# EAGLE design extruder-controller (EAGLE 5.10)
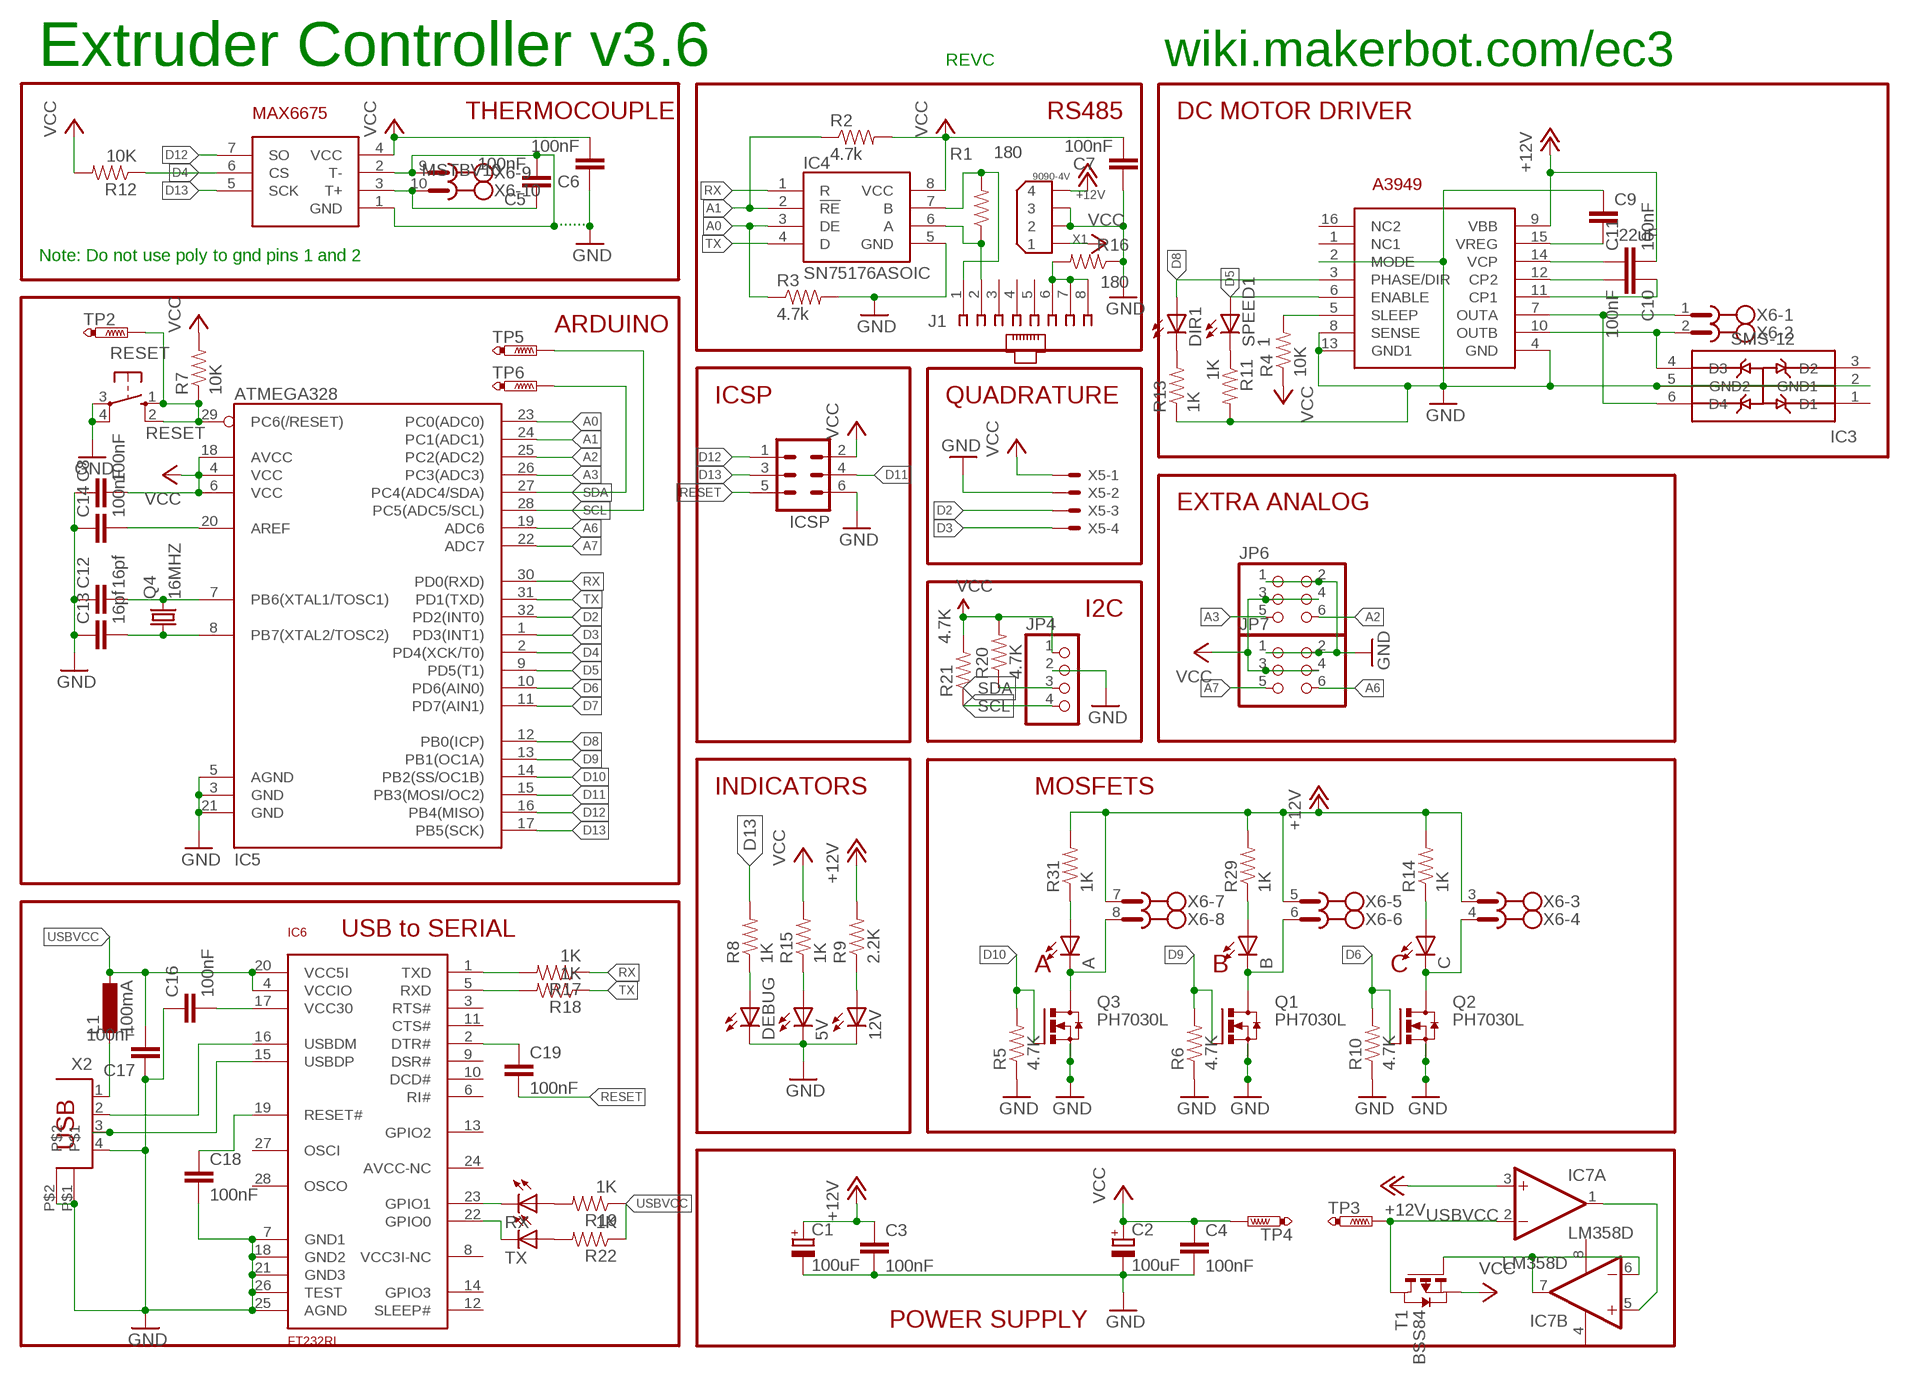
[diagram p0: schematic, sheet 1]

## Parts
5V  LED0805  [LED-0805]
12V  LED0805  [LED-0805]
A  LED0805  [LED-0805]
B  LED0805  [LED-0805]
C  LED0805  [LED-0805]
C1  100uF  CPOL-EUE3.5-8  [E3,5-8]
C2  100uF  CPOL-EUE3.5-8  [E3,5-8]
C3  100nF  CAP0805  [0805]
C4  100nF  CAP0805  [0805]
C5  100nF  CAP0805  [0805]
C6  100nF  CAP0805  [0805]
C7  100nF  CAP0805  [0805]
C8  100nF  CAP0805  [0805]
C9  .22uF  CAP0805  [0805]
C10  100nF  CAP0805  [0805]
C11  100nF  CAP0805  [0805]
C12  16pf  CAP0805  [0805]
C13  16pf  CAP0805  [0805]
C14  100nF  CAP0805  [0805]
C16  100nF  CAP0805  [0805]
C17  100nF  CAP0805  [0805]
C18  100nF  CAP0805  [0805]
C19  100nF  CAP0805  [0805]
DEBUG  LED0805  [LED-0805]
DIR1  LED0805  [LED-0805]
IC2  A3949  [SO16W]
IC3  SMS-12  TVS-DIODE-ARRAY  [SOT23-6]
IC4  SN75176ASOIC  [SO08]
IC5  ATMEGA328  ATMEGA168  [TQFP32-08]
IC6  FT232RL  [SMARTPRJ_SSOP28]
IC7  LM358D  [SO08]
IC8  MAX6675  [SO08]
ICSP  ML6  [ML6]
J1  520426-4  [520426-4]
JP4  PINHD-1X4  [1X04]
JP6  PINHD-2X3  [2X03]
JP7  PINHD-2X3  [2X03]
L1  100mA  L-EUL1812  [L1812]
Q1  PH7030L  [SOT669]
Q2  PH7030L  [SOT669]
Q3  PH7030L  [SOT669]
Q4  16MHZ  CRYSTALHC49S  [HC49/S]
R1  180  RESISTOR  [0805]
R2  4.7k  RESISTOR  [0805]
R3  4.7k  RESISTOR  [0805]
R4  10K  RESISTOR  [0805]
R5  4.7K  RESISTOR  [0805]
R6  4.7K  RESISTOR  [0805]
R7  10K  RESISTOR  [0805]
R8  1K  RESISTOR  [0805]
R9  2.2K  RESISTOR  [0805]
R10  4.7K  RESISTOR  [0805]
R11  1K  RESISTOR  [0805]
R12  10K  RESISTOR  [0805]
R13  1K  RESISTOR  [0805]
R14  1K  RESISTOR  [0805]
R15  1K  RESISTOR  [0805]
R16  180  RESISTOR  [0805]
R17  1K  RESISTOR  [0805]
R18  1K  RESISTOR  [0805]
R19  1K  RESISTOR  [0805]
R20  4.7K  RESISTOR  [0805]
R21  4.7K  RESISTOR  [0805]
R22  1K  RESISTOR  [0805]
R29  1K  RESISTOR  [0805]
R31  1K  RESISTOR  [0805]
RESET  10-XX  [B3F-10XX]
RX  LED0805  [LED-0805]
SPEED1  1  LED0805  [LED-0805]
T1  BSS84  PMOSSOT23  [SOT-23]
TP2  PTR1TP09R  [TP09R]
TP3  PTR1TP09R  [TP09R]
TP4  PTR1TP09R  [TP09R]
TP5  PTR1TP09R  [TP09R]
TP6  PTR1TP09R  [TP09R]
TX  LED0805  [LED-0805]
X1  9090-4V  [9090-4V]
X2  USBA  [SMARTPRJ_PN61729]
X5  C-GRID-04-70543  [70543-04]
X6  MSTBV10  [MSTBV10]

## Nets
+12V [power]: C1.+ C3.1 C11.2 IC2.9(VBB) IC7.3(A:+IN) R9.2 R14.2 R29.2 R31.2 X1.4 X6.3 X6.5 X6.7
A0: IC4.3(DE) IC5.23(PC0(ADC0)) R3.1
A1: IC4.2(!RE) IC5.24(PC1(ADC1)) R2.1
A2: IC5.25(PC2(ADC2)) JP6.6
A3: IC5.26(PC3(ADC3)) JP6.5
A6: IC5.19(ADC6) JP7.6
A7: IC5.22(ADC7) JP7.5
APWR [power]: A.C Q3.MB(D) X6.8
BPWR [power]: B.C Q1.MB(D) X6.6
CPWR: C.C Q2.MB(D) X6.4
D2: IC5.32(PD2(INT0)) X5.3
D3: IC5.1(PD3(INT1)) X5.4
D4: IC5.2(PD4(XCK/T0)) IC8.6(CS) R12.1
D5: IC2.6(ENABLE) IC5.9(PD5(T1)) SPEED1.A
D6: IC5.10(PD6(AIN0)) Q2.4(G) R10.2
D7: IC5.11(PD7(AIN1))
D8: DIR1.A IC2.3(PHASE/DIR) IC5.12(PB0(ICP))
D9: IC5.13(PB1(OC1A)) Q1.4(G) R6.2
D10: IC5.14(PB2(SS/OC1B)) Q3.4(G) R5.2
D11: IC5.15(PB3(MOSI/OC2)) ICSP.4
D12: IC5.16(PB4(MISO)) IC8.7(SO) ICSP.1
D13: IC5.17(PB5(SCK)) IC8.5(SCK) ICSP.3 R8.2
GND [power]: 5V.C 12V.C C1.- C2.- C3.2 C4.2 C6.1 C7.1 C8.1 C9.1 C12.1 C13.1 C14.1 C16.1 C17.1 C18.2 DEBUG.C IC2.2(MODE) IC2.4(GND) IC2.8(SENSE) IC2.13(GND1) IC3.2(GND1) IC3.5(GND2) IC4.5(GND) IC5.3(GND) IC5.5(AGND) IC5.21(GND) IC6.7(GND1) IC6.18(GND2) IC6.21(GND3) IC6.25(AGND) IC6.26(TEST) ICSP.6 JP4.2 JP6.1 JP6.2 JP7.1 JP7.2 Q1.1(S) Q1.2(S) Q1.3(S) Q2.1(S) Q2.2(S) Q2.3(S) Q3.1(S) Q3.2(S) Q3.3(S) R3.2 R5.1 R6.1 R10.1 R11.2 R13.1 R16.1 RESET.3(P) RESET.4(P1) X1.2 X1.3 X2.4 X2.P$1 X2.P$2 X5.2
N$1: C5.2 IC8.1(GND) IC8.2(T-) X6.9
N$2: C.A R14.1
N$3: C9.2 IC2.15(VREG)
N$4 [motors]: IC2.7(OUTA) IC3.6(D4) X6.1
N$5 [motors]: IC2.10(OUTB) IC3.4(D3) X6.2
N$6: C10.2 IC2.12(CP2)
N$7: C10.1 IC2.11(CP1)
N$8: DEBUG.A R8.1
N$9: C11.1 IC2.14(VCP)
N$11: C5.1 IC8.3(T+) X6.10
N$12: IC2.5(SLEEP) R4.2
N$18: R11.1 SPEED1.C
N$20: C14.2 IC5.20(AREF)
N$23: DIR1.C R13.2
N$25: 5V.A R15.1
N$26: 12V.A R9.1
N$29: IC6.15(USBDP) X2.3
N$30: IC6.16(USBDM) X2.2
N$31: C12.2 IC5.7(PB6(XTAL1/TOSC1)) Q4.2
N$32: C13.2 IC5.8(PB7(XTAL2/TOSC2)) Q4.1
N$36: C18.1 IC6.19(RESET#)
N$37: L1.2 X2.1
N$38: C16.2 IC6.17(VCC30)
N$39: R19.2 RX.A
N$40: R22.2 TX.A
N$41: A.A R31.1
N$42: B.A R29.1
N$44: IC6.23(GPIO1) RX.C
N$45: IC6.22(GPIO0) TX.C
N$46: C19.1 IC6.2(DTR#)
N$47: IC6.1(TXD) R17.2
N$48: IC6.5(RXD) R18.2
N$50: IC7.1(A:OUT) IC7.5(B:+IN)
N$51: IC7.6(B:-IN) IC7.7(B:OUT) T1.3(G)
N$83: J1.6 J1.7 J1.8 R16.2
RESET: C19.2 IC5.29(PC6(/RESET)) ICSP.5 R7.1 RESET.1(S) RESET.2(S1) TP2.TP
RS485A: IC4.6(A) J1.2 R1.1
RS485B: IC4.7(B) J1.1 R1.2
RX: IC4.1(R) IC5.30(PD0(RXD)) R17.1
SCL: IC5.28(PC5(ADC5/SCL)) JP4.4 R21.1 TP5.TP
SDA: IC5.27(PC4(ADC4/SDA)) JP4.3 R20.1 TP6.TP
TX: IC4.4(D) IC5.31(PD1(TXD)) R18.1
USBVCC: C17.2 IC6.4(VCCIO) IC6.20(VCC5I) IC7.2(A:-IN) L1.1 R19.1 R22.1 T1.1(D) TP3.TP
VCC: C2.+ C4.1 C6.2 C7.2 C8.2 IC4.8(VCC) IC5.4(VCC) IC5.6(VCC) IC5.18(AVCC) IC8.4(VCC) ICSP.2 JP4.1 JP6.3 JP6.4 JP7.3 JP7.4 R2.2 R4.1 R7.2 R12.2 R15.2 R20.2 R21.2 T1.2(S) TP4.TP X1.1 X5.1
Unconnected: IC2.1(NC1) IC2.16(NC2) IC3.1(D1) IC3.3(D2) IC6.3(RTS#) IC6.6(RI#) IC6.8(VCC3I-NC) IC6.9(DSR#) IC6.10(DCD#) IC6.11(CTS#) IC6.12(SLEEP#) IC6.13(GPIO2) IC6.14(GPIO3) IC6.24(AVCC-NC) IC6.27(OSCI) IC6.28(OSCO) J1.3 J1.4 J1.5

## Notes on the sheet
- wiki.makerbot.com/ec3
- Extruder Controller v3.6 | REVC
- THERMOCOUPLE | RS485 | DC MOTOR DRIVER
- .......
- Note: Do not use poly to gnd pins 1 and 2
- ARDUINO
- ICSP | QUADRATURE
- EXTRA ANALOG
- I2C
- INDICATORS | MOSFETS
- USB to SERIAL
- A | B | C
- POWER SUPPLY

## Power pins joined to a net without a drawn wire
V+: IC7.8(P:V+)
V-: IC7.4(P:V-)

## Library data of the parts
5V 12V A B C DEBUG DIR1 RX SPEED1 TX = SparkFun:LED: LEDs Standard schematic elements and footprints for 5mm, 3mm, 1206, and 0603 sized LEDs. 5mm - Spark Fun Electronics SKU : COM-00529 (and others)
C1 C2 = rcl:CPOL-EU: POLARIZED CAPACITOR, European symbol
C3-C14 C16-C19 = SparkFun:CAP: Capacitor Standard 0603 ceramic capacitor, and 0.1" leaded capacitor.
IC2 = reprap:A3949
IC3 = reprap:TVS-DIODE-ARRAY: Transient Voltage Protection Diode Array
IC4 = reprap:SN75176A
IC5 = SparkFun:ATMEGA168
IC6 = reprap:FT232RL
IC7 = linear:LM358: OP AMP also LM158; LM258; LM2904 Source: http://cache.national.com/ds/LM/LM158.pdf
IC8 = reprap:MAX6675: Thermocouple amplifier and A to D converter
ICSP = con-harting-ml:ML6: HARTING
J1 = con-amp:520426-4: AMP connector
JP4 = pinhead:PINHD-1X4: PIN HEADER
JP6 JP7 = pinhead:PINHD-2X3: PIN HEADER
L1 = resistor:L-EU: INDUCTOR, European symbol
Q1-Q3 = transistor-power:PH7030L: N-channel TrenchMOS (TM) logic level FET Source: http://www.nxp.com/acrobat_download/datasheets/PH7030L_4.pdf
Q4 = crystal:CRYSTAL: CRYSTAL
R1-R22 R29 R31 = SparkFun:RESISTOR: Resistor Basic schematic elements and footprints for 0603, 1206, and PTH 1/10th watt (small) resistors.
RESET = switch-omron:10-XX: OMRON SWITCH
T1 = zetex:PMOSSOT23: MOS FET
TP2-TP6 = testpad:PTR1: TEST PIN
X1 = con-thomas-betts:9090-4: Disk Drive Power four position Source: Thomas & Betts Electronic Interconnects Eiropean Edition 1998
X2 = reprap:USBA: BERG USB connector
X5 = reprap:C-GRID-04: CONNECTOR wire to board 2.54 mm (0.100") pitch header
X6 = con-phoenix-508:MSTBV10: PHOENIX

## Net classes
0 default: width 0.305 mm
1 power: width 1.016 mm
2 motors: width 0.61 mm

## Board
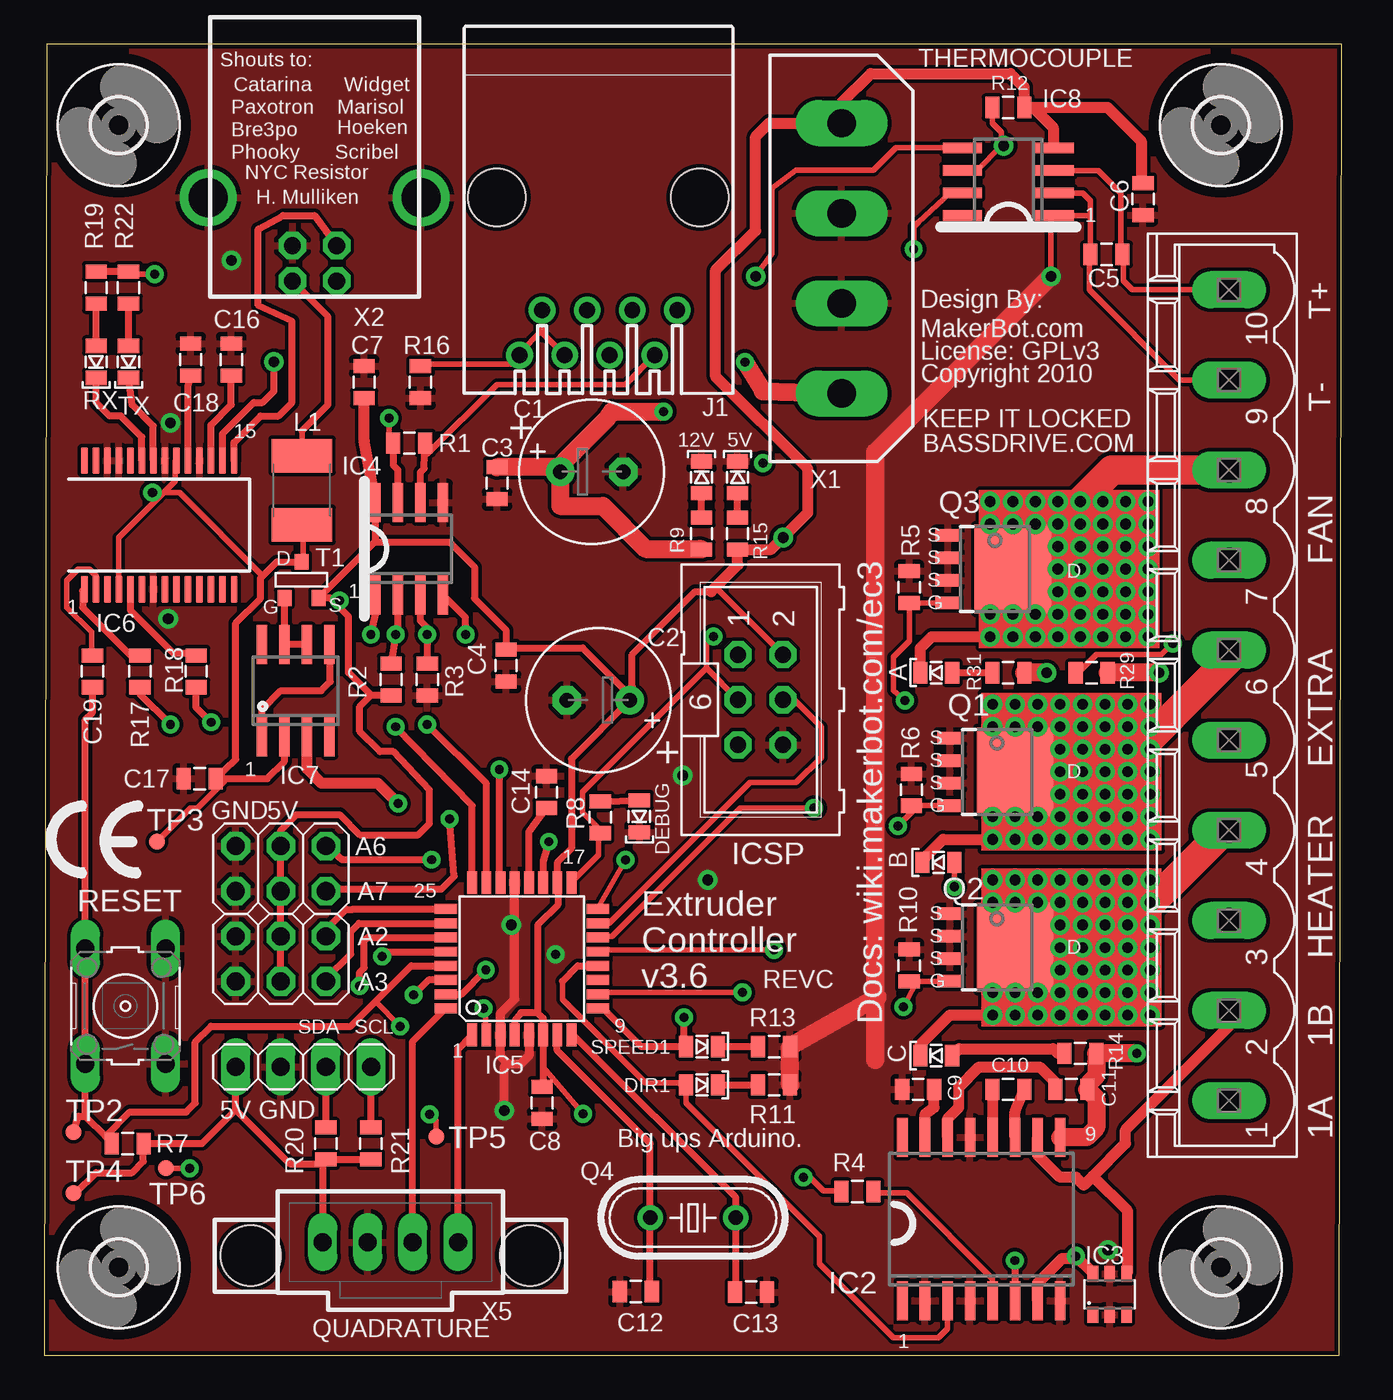
[diagram p1: board, top side]
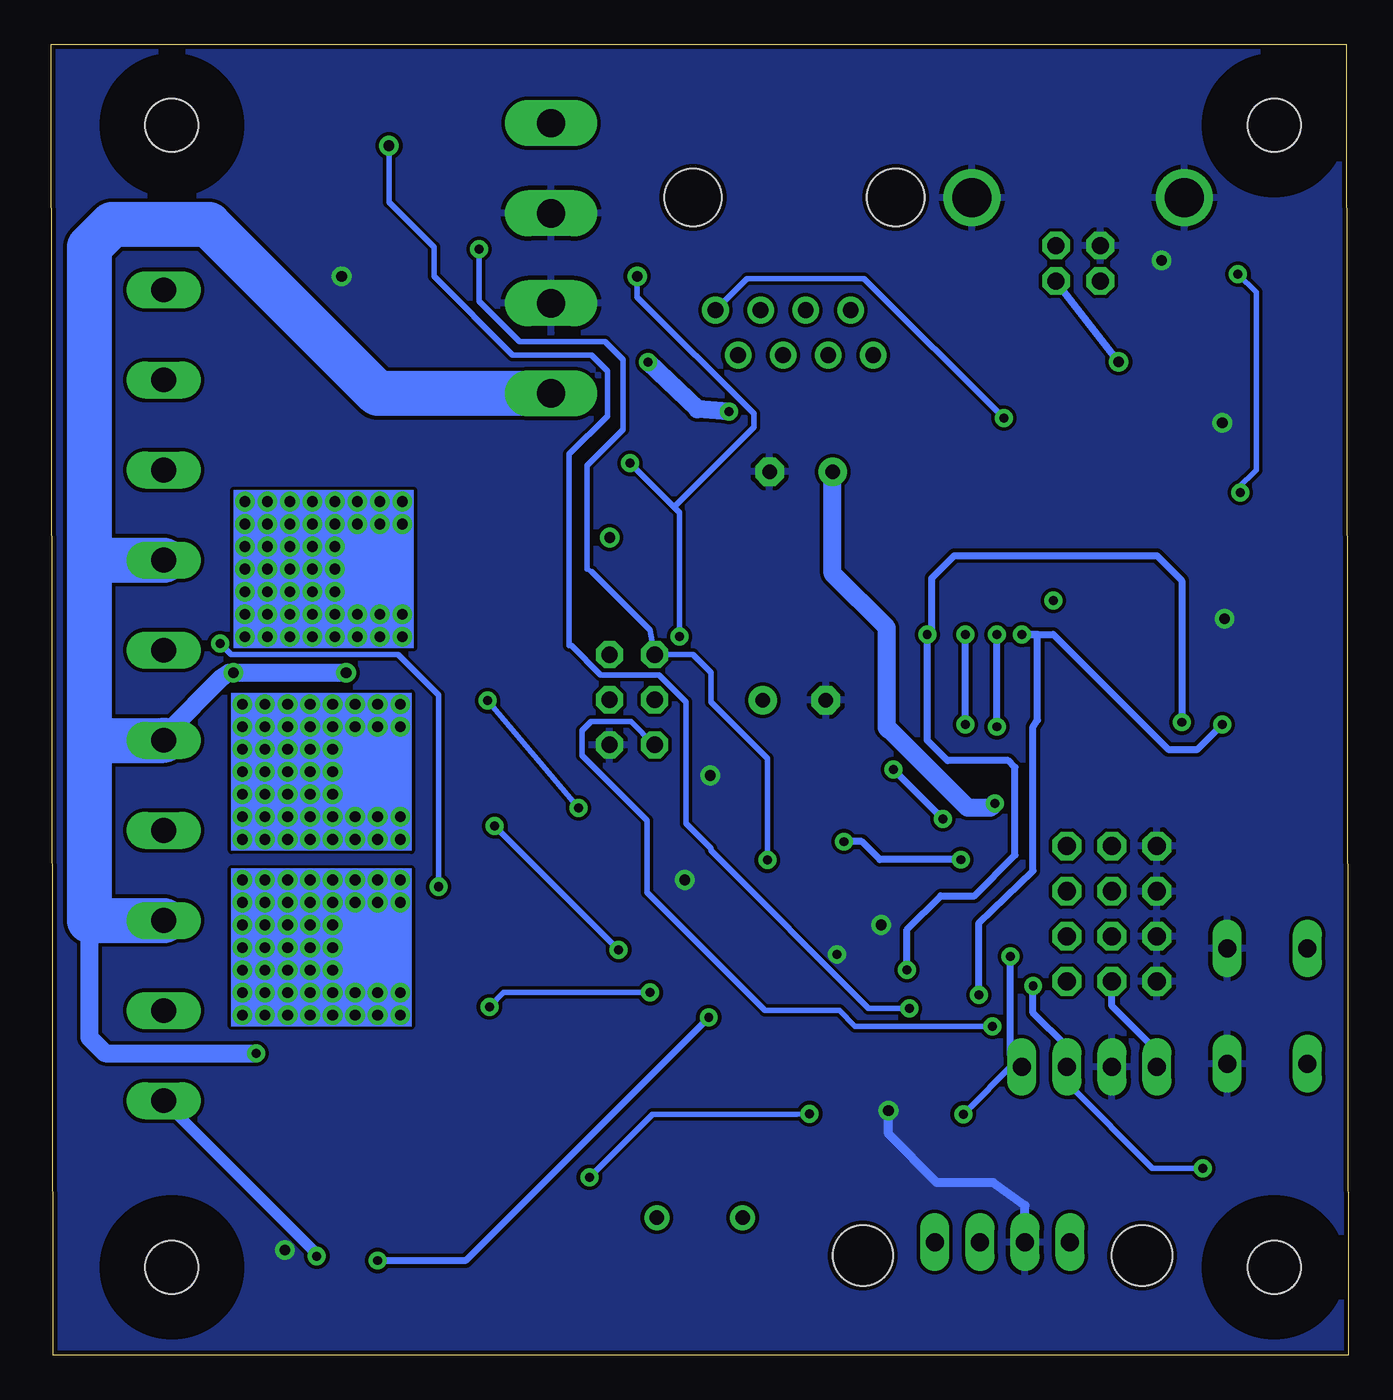
[diagram p2: board, bottom side, seen from below]

Size 73.15 x 73.91 mm. Coordinates in mm from the lower left corner, seen from the top.
Outline: 0,0 73.02,0 73.15,73.91 0.13,73.91 0,0
Copper layers (1*16): Top 0.035mm / dielectric 1.5mm / Bottom 0.035mm
Design rules "SparkFun *": minimum track width 8mil, minimum drill 20mil, track to track 8mil, track to pad 8mil, pad to pad 8mil, via to via 8mil, smd to smd 2mil, copper to edge 10mil, drill to drill 8mil, minimum pad ring 12mil, minimum via ring 10mil, stop-mask expansion 4mil, vias tented up to drill 25mil, thermal gap 10mil

### Footprints (pad centres in the part's own frame; a part is rotated, then mirrored left to right if it is on the bottom)
LED-0805 = smd 1.2 x 0.8: A 0,-0.9; C 0,0.9
E3,5-8 = drill 0.813 pad 1.6 round: + -1.778,0 | drill 0.813 pad 1.6 octagon: - 1.778,0
0805 = smd 0.8 x 1.2: 1 -0.9,0; 2 0.9,0
SO16W = smd 0.6 x 2.2: 1 -4.445,-4.6; 2 -3.175,-4.6; 3 -1.905,-4.6; 4 -0.635,-4.6; 5 0.635,-4.6; 6 1.905,-4.6; 7 3.175,-4.6; 8 4.445,-4.6; 9 4.445,4.6; 10 3.175,4.6; 11 1.905,4.6; 12 0.635,4.6; 13 -0.635,4.6; 14 -1.905,4.6; 15 -3.175,4.6; 16 -4.445,4.6
SOT23-6 = smd 0.6 x 0.9: 1 -0.95,-1.15; 2 0,-1.15; 3 0.95,-1.15; 4 0.95,1.15; 5 0,1.15; 6 -0.95,1.15
SO08 = smd 0.6 x 2.2: 1 -1.905,-2.6; 2 -0.635,-2.6; 3 0.635,-2.6; 4 1.905,-2.6; 5 1.905,2.6; 6 0.635,2.6; 7 -0.635,2.6; 8 -1.905,2.6
TQFP32-08 = smd 1.27 x 0.559: 1 -4.293,2.8; 2 -4.293,2; 3 -4.293,1.2; 4 -4.293,0.4; 5 -4.293,-0.4; 6 -4.293,-1.2; 7 -4.293,-2; 8 -4.293,-2.8; 17 4.293,-2.8; 18 4.293,-2; 19 4.293,-1.2; 20 4.293,-0.4; 21 4.293,0.4; 22 4.293,1.2; 23 4.293,2; 24 4.293,2.8 | smd 0.559 x 1.27: 9 -2.8,-4.293; 10 -2,-4.293; 11 -1.2,-4.293; 12 -0.4,-4.293; 13 0.4,-4.293; 14 1.2,-4.293; 15 2,-4.293; 16 2.8,-4.293; 25 2.8,4.293; 26 2,4.293; 27 1.2,4.293; 28 0.4,4.293; 29 -0.4,4.293; 30 -1.2,4.293; 31 -2,4.293; 32 -2.8,4.293
SMARTPRJ_SSOP28 = smd 0.381 x 1.499: 1 -4.225,-3.625; 2 -3.575,-3.625; 3 -2.925,-3.625; 4 -2.275,-3.625; 5 -1.625,-3.625; 6 -0.975,-3.625; 7 -0.325,-3.625; 8 0.325,-3.625; 9 0.975,-3.625; 10 1.625,-3.625; 11 2.275,-3.625; 12 2.925,-3.625; 13 3.575,-3.625; 14 4.225,-3.625; 15 4.225,3.625; 16 3.575,3.625; 17 2.925,3.625; 18 2.275,3.625; 19 1.625,3.625; 20 0.975,3.625; 21 0.325,3.625; 22 -0.325,3.625; 23 -0.975,3.625; 24 -1.625,3.625; 25 -2.275,3.625; 26 -2.925,3.625; 27 -3.575,3.625; 28 -4.225,3.625
ML6 = drill 0.914 octagon: 1 -2.54,-1.27; 2 -2.54,1.27; 3 0,-1.27; 4 0,1.27; 5 2.54,-1.27; 6 2.54,1.27
520426-4 = drill 0.889 round: 1 -4.445,6.35; 2 -3.175,8.89; 3 -1.905,6.35; 4 -0.635,8.89; 5 0.635,6.35; 6 1.905,8.89; 7 3.175,6.35; 8 4.445,8.89 | hole 3.251: -5.715,0; 5.715,0
1X04 = drill 1.016 long: 1 -3.81,0; 2 -1.27,0; 3 1.27,0; 4 3.81,0
2X03 = drill 1.016 octagon: 1 -2.54,-1.27; 2 -2.54,1.27; 3 0,-1.27; 4 0,1.27; 5 2.54,-1.27; 6 2.54,1.27
L1812 = smd 1.9 x 3.4: 1 -1.95,0; 2 1.95,0
SOT669 = smd 0.7 x 1.4: 1 -1.905,-2.65; 2 -0.635,-2.65; 3 0.635,-2.65; 4 1.905,-2.65 | smd 5 x 4.3: MB 0,1
HC49/S = drill 0.813 round: 1 -2.413,0; 2 2.413,0
B3F-10XX = drill 1.016 long: 1 -3.251,2.261; 2 3.251,2.261; 3 -3.251,-2.261; 4 3.251,-2.261
SOT-23 = smd 0.787 x 0.889: 1 0.025,-1.016; 2 -0.94,1.016; 3 0.991,1.016
TP09R = smd 0.9 x 0.9: TP 0,0
3,0 = hole 3: 0,0
9090-4V = drill 1.6 pad 2.6 long: 1 -7.62,0; 2 -2.54,0; 3 2.54,0; 4 7.62,0
SMARTPRJ_PN61729 = drill 0.95 octagon: 1 1.25,4.71; 2 -1.25,4.71; 3 -1.25,2.71; 4 1.25,2.71 | drill 2.2 round: P$1 -6,0; P$2 6,0
70543-04 = drill 1.016 long: 1 -3.81,0; 2 -1.27,0; 3 1.27,0; 4 3.81,0 | hole 3.404: -7.874,-0.762; 7.874,-0.762
MSTBV10 = drill 1.397 long: 1 -22.86,0; 2 -17.78,0; 3 -12.7,0; 4 -7.62,0; 5 -2.54,0; 6 2.54,0; 7 7.62,0; 8 12.7,0; 9 17.78,0; 10 22.86,0

### Placement (x,y rotation side)
5V  39.09,49.5 0 top
12V  37.06,49.5 0 top
A  50.29,38.48 90 top
B  50.42,27.79 90 top
C  50.29,16.89 90 top
C1  30.86,49.81 0 top
C2  31.24,36.93 180 top
C3  25.53,49.17 270 top
C4  26.04,38.89 270 top
C5  59.89,62.07 180 top
C6  61.95,65.19 90 top
C7  18.03,54.86 270 top
C8  28.07,14.22 90 top
C9  49.28,14.99 0 top
C10  54.36,14.99 180 top
C11  57.91,14.99 0 top
C12  33.35,3.58 0 top
C13  39.85,3.56 180 top
C14  28.32,31.75 270 top
C16  10.54,56.13 270 top
C17  8.76,32.51 0 top
C18  8.26,56.13 90 top
C19  2.72,38.56 270 top
DEBUG  33.55,30.38 180 top
DIR1  37.08,15.24 270 top
IC2  52.83,7.67 0 top
IC3  60.07,3.43 0 top
IC4  20.57,45.47 0 top
IC5  26.92,22.35 90 top
IC6  6.48,46.81 0 top
IC7  14.17,37.47 0 top
IC8  54.36,66.17 90 top
ICSP  40.39,36.96 270 top
J1  31.24,65.28 180 top
JP4  14.61,16.26 0 top
JP6  13.34,22.35 0 top
JP7  13.34,27.43 0 top
L1  14.53,48.77 90 top
Q1  53.72,32.89 270 top
Q2  53.72,22.99 270 top
Q3  53.59,44.32 270 top
Q4  36.58,7.75 180 top
R1  20.57,51.44 180 top
R2  19.56,38.1 270 top
R3  21.59,38.1 270 top
R4  45.85,9.22 0 top
R5  48.77,43.31 270 top
R6  48.9,31.88 270 top
R7  4.7,11.94 0 top
R8  31.34,30.33 270 top
R9  37.06,46.33 270 top
R10  48.77,21.97 270 top
R11  41.15,17.4 0 top
R12  54.36,70.36 0 top
R13  41.15,15.24 180 top
R14  58.42,17.02 0 top
R15  39.09,46.33 270 top
R16  21.21,54.86 90 top
R17  5.38,38.56 90 top
R18  8.56,38.56 90 top
R19  2.92,60.2 270 top
R20  15.88,11.94 270 top
R21  18.41,11.94 270 top
R22  4.75,60.2 270 top
R29  59.05,38.48 0 top
R31  54.36,38.48 0 top
RESET  4.57,19.68 90 top
RX  2.92,56.01 180 top
SPEED1  37.08,17.4 270 top
T1  14.53,43.71 180 top
TP2  1.65,12.57 0 top
TP3  6.35,28.96 0 top
TP4  1.65,9.14 0 top
TP5  22.1,12.32 0 top
TP6  6.86,10.54 0 top
TX  4.75,56.01 180 top
U$1  [3,0]  4.19,4.95 0 top
U$2  [3,0]  4.19,69.35 0 top
U$3  [3,0]  66.34,69.35 0 top
U$4  [3,0]  66.34,4.95 0 top
X1  44.96,61.85 270 top
X2  15.24,65.28 180 top
X5  19.51,6.38 0 top
X6  66.8,37.21 90 top

### Tracks (layer width: path | path; a pad name or v marks a point on that pad's centre or on a via)
+12V  (via drill 0.5, 0.51, 0.6)
  Top 0.61: v61.6,17.02 61.58,17.01 | v19.94,31.11 18.8,32.26 15.62,32.26 14.81,33.07 IC7.3
  Top 1.016: C1.+ 29.08,50.04 | C1.+ 29.08,47.88 31.5,47.88 33.91,45.47 36.96,45.47 R9.2 | v62.87,38.48 R29.2 | v56.52,38.48 R31.2 | C1.+ 29.34,50.42 31.75,52.83 32,53.21 v34.93,53.21 | v39.5,56.01 40.51,54.36 X1.4 | R14.2 59.31,17.01 | C1.+ 28.82,50.07 C3.1 | R14.2 59.31,16.51 59.31,15.75 58.93,15.37 C11.2 59.31,14.49 59.31,12.83 58.78,12.3 IC2.9 | v61.6,17.02 R14.2
  Bottom 1.016: v19.94,31.11 20.19,30.86 21.46,30.86 25.83,35.23 25.88,35.23 26.04,35.38 26.04,41.02 29.08,44.07 C1.+ | v56.52,38.48 v62.87,38.48 63.12,38.48 63.5,38.23 66.67,35.05 X6.5 | v34.93,53.21 36.7,53.34 v39.5,56.01 | v61.6,17.02 70.1,17.02 70.99,17.91 70.99,24.51
  Bottom 2.54: X1.4 54.74,54.23 64.26,63.75 69.72,63.75 70.99,62.48 70.99,44.83 | 70.99,44.83 70.99,34.67 | X6.3 70.99,24.51 70.99,34.67 | 70.99,34.67 X6.5 | 70.99,44.83 X6.7
A0  (via drill 0.5)
  Top 0.406: R3.1 v21.59,40.64 21.59,41.02 21.21,41.4 IC4.3 | IC5.23 24.92,32.23 v21.59,35.56
  Bottom 0.406: v21.59,35.56 v21.59,40.64
A1  (via drill 0.5)
  Top 0.406: IC4.2 19.94,41.02 v19.81,40.64 R2.1 | IC5.24 24.12,30.99 v19.81,35.43
  Bottom 0.406: v19.81,35.43 v19.81,40.64
A2
  Top 0.406: IC5.25 17.4,25.15 17.02,25.15 16,24.13 JP6.6
A3
  Top 0.406: IC5.26 17.75,24.35 17.27,23.88 17.27,22.61 15.88,21.21 JP6.5
A6  (via drill 0.5)
  Top 0.406: IC5.19 28.12,27.87 v28.45,28.96 | v21.84,27.94 16.76,27.94 JP7.6
  Bottom 0.406: v28.45,28.96 27.43,28.96 26.42,27.94 v21.84,27.94
A7  (via drill 0.5)
  Top 0.406: v22.86,30.23 23.11,27.01 22.4,26.29 16,26.29 JP7.5 | IC5.22 25.65,26.64 v25.65,33.02
  Bottom 0.406: v22.86,30.23 v25.65,33.02
APWR
  Top 0.61: A.C 49.39,39.87 50.04,40.51 54.61,40.51 54.61,44.31 Q3.MB
  Top 1.676: X6.8 60.18,49.91 Q3.MB
BPWR
  Top 0.61: Q1.MB 54.72,29.1 54.71,29.08 50.67,29.08 49.52,27.93 B.C
  Top 1.676: X6.6 66.8,39.22 60.48,32.89 Q1.MB
CPWR
  Top 0.61: C.C 49.39,17.52 51.05,19.18 54.74,19.18 54.72,19.19 Q2.MB
  Top 1.676: X6.4 66.52,29.59 59.92,22.99 Q2.MB
D2
  Top 0.406: X5.3 20.78,17.7 IC5.32
D3
  Top 0.406: X5.4 23.32,17.25 IC5.1
D4  (via drill 0.51, 0.6)
  Top 0.305: v24.77,19.56 24.89,19.43 24.89,18.16 IC5.2 | R12.1 53.47,69.47 53.98,68.96 53.98,68.33 v54.1,68.2 53.98,68.2 52.58,66.8 IC8.6
  Bottom 0.305: v24.77,19.56 27.05,19.56 35.94,28.45 35.94,28.57 37.34,29.97 37.34,36.83 38.86,38.35 42.16,38.35 43.82,40.01 43.94,40.01 43.94,50.8 41.78,52.96 41.78,55.5 42.67,56.39 47.12,56.39 51.56,60.83 51.56,62.48 54.1,65.02 v54.1,68.2
D5  (via drill 0.5)
  Top 0.305: v36.07,19.05 36.2,19.18
  Top 0.406: IC5.9 31.5,19.55 33.66,17.4 SPEED1.A 36.07,17.43 v36.07,19.05 | v54.74,5.33 IC2.6
  Bottom 0.406: v54.74,5.33 49.78,5.33 v36.07,19.05
D6  (via drill 0.51)
  Top 0.305: Q2.4 48.78,21.08 R10.2 49.15,20.95 v48.44,19.63 | v39.37,20.45 31.24,20.45 IC5.10
  Bottom 0.305: v39.37,20.45 47.62,20.45 v48.44,19.63
D8
  Top 0.305: 29.21,21.08 29.21,20.07 33.91,15.37 35.91,15.37 DIR1.A 36.2,14.99 36.2,14.22 43.71,6.71 43.71,5.16 47.88,0.99 50.42,0.99 50.93,1.5 IC2.3
  Top 0.406: IC5.12 30.08,21.95 29.21,21.08
  Top 0.61: 36.07,15.21 DIR1.A
D9  (via drill 0.51)
  Top 0.305: v41.15,22.86 31.24,22.86 IC5.13 | v48.13,29.84 49.15,30.86 R6.2 Q1.4
  Bottom 0.305: v41.15,22.86 v48.13,29.84
D10  (via drill 0.51)
  Top 0.305: IC5.14 31.24,23.62 32,23.62 39.24,30.86 v43.41,30.86 | v48.54,36.91 47.88,37.47 47.88,39.37 48.77,40.26 R5.2 48.78,42.42 Q3.4
  Bottom 0.305: v43.41,30.86 v48.54,36.91
D11
  Top 0.305: IC5.15 31.84,24.35 39.78,32.28 42.39,32.28 43.82,33.71 43.82,35.43 42.19,37.06 41.78,37.06 41.78,37.08 ICSP.4
D12  (via drill 0.5, 0.51)
  Top 0.305: v32.77,27.91 31.24,25.27 IC5.16 | v49.02,62.36 49.02,63.63 49.28,63.88 51.05,65.53 IC8.7
  Bottom 0.305: v32.77,27.91 32.77,33.66 35.94,36.83 35.94,38.48 36.96,39.5 ICSP.1 39.37,40.89 42.67,44.2 42.93,44.32 42.93,50.17 40.89,52.2 40.89,56.13 41.91,57.15 46.74,57.15 49.02,59.44 v49.02,62.36
D13  (via drill 0.51, 0.6 pad 0)
  Top 0.305: IC5.17 29.72,26.67 31.24,28.19 31.24,29.34 R8.2 31.24,29.46 31.24,29.72 30.35,30.61 30.35,31.75 37.34,38.73 | v37.72,40.51 37.34,40.13 37.34,38.73 | 37.34,38.73 ICSP.3 | IC8.5 48.01,68.07 46.76,66.83 42.39,66.83 41.02,65.81 41.02,62.1 v40.11,60.83
  Bottom 0.305: 38.04,47.82 37.72,47.5 v37.72,40.51 | 38.04,47.82 v40.51,50.29 | 38.04,47.82 33.53,52.32 33.53,53.09 40.11,59.67 v40.11,60.83
GND  (via drill 0.51, 0.6, 0.6 pad 0)
  Top 0.508: IC5.21 26.52,20.07 25.73,19.28 IC5.3 | IC5.3 | IC5.3 25.73,16.84 26.14,16.43 | 26.14,16.43 26.85,16.43 27.36,16.94 27.36,18.03 IC5.5 | v25.93,13.79 25.93,16.23 26.14,16.43
  Top 1.016: 46.99,20.19 R11.2 R13.1 | v56.77,60.83 46.86,50.93 46.86,16.64
  Bottom 0.508: X5.2 18.24,8.43 20.04,9.73 23.19,9.73 25.93,12.47 v25.93,13.79
  other vias: 7.11,52.58 6.98,41.53 10.54,61.72 59.97,5.92 26.34,24.26 28.83,22.61 35.99,32.69 37.41,26.8
  pour Top: -1.14,74.55 73.79,74.55 73.79,-1.65 -1.14,-1.65
  pour Bottom: -1.14,74.55 73.79,74.55 73.79,-1.65 -1.14,-1.65
N$1
  Top 0.305: X6.9 64.01,54.99 58.93,60.07 58.93,62.01 C5.2 58.99,64.26 | 58.99,64.26 58.99,65.09 58.55,65.53 IC8.2 | 58.99,64.26 IC8.1 56.77,64.08 56.77,60.83
N$2
  Top 0.61: R14.1 57.15,17.02 56.9,17.27 51.57,17.27 C.A
N$3
  Top 0.61: IC2.15 49.66,13.59 50.16,13.97 50.16,14.97 C9.2
N$4  (via drill 0.51)
  Top 0.61: IC3.6 59.05,4.7 v58.17,5.59 57.91,5.46 57.4,5.46 56.01,4.06 IC2.7
  Bottom 0.61: X6.1 58.42,5.97 58.29,5.71 v58.17,5.59
N$5
  Top 0.61: IC2.10 56.01,11.3 57.28,10.03 58.17,10.03 58.61,9.59 59.12,10.1 | X6.2 66.8,18.54 60.96,12.7 60.96,11.94 59.12,10.1 | IC3.4 61.09,4.7 61.09,8.13 59.12,10.1
N$6
  Top 0.61: IC2.12 53.47,14.97 C10.2
N$7
  Top 0.61: C10.1 54.74,13.72 IC2.11
N$8
  Top 0.406: R8.1 DEBUG.A
N$9
  Top 0.61: C11.1 57.01,15.38 56.13,16.26 52.71,16.26 51.56,15.11 51.56,13.97 50.93,13.33 IC2.14
N$10  (via drill 0.6 pad 0)
  other vias: 53.34,48.13
N$11
  Top 0.305: X6.10 61.34,60.07 60.83,60.58 60.83,62.03 C5.1 60.71,62.16 60.71,65.53 59.44,66.8 IC8.3
N$12
  Top 0.305: R4.2 46.86,9.14 48.64,9.14 53.47,4.32 IC2.5
N$13  (via drill 0.6 pad 0)
  other vias: 54.61,48.13
N$14  (via drill 0.6 pad 0)
  other vias: 55.88,48.13
N$15  (via drill 0.6 pad 0)
  other vias: 57.15,48.13
N$16  (via drill 0.6 pad 0)
  other vias: 58.42,48.13
N$17  (via drill 0.6 pad 0)
  other vias: 59.69,48.13
N$18
  Top 0.406: SPEED1.C R11.1
N$19  (via drill 0.6 pad 0)
  other vias: 60.96,48.13
N$20
  Top 0.406: IC5.20 27.32,29.51 C14.2
N$21  (via drill 0.6 pad 0)
  other vias: 62.23,48.13
N$22  (via drill 0.6 pad 0)
  other vias: 62.23,46.86
N$23
  Top 0.406: DIR1.C R13.2
N$24  (via drill 0.6 pad 0)
  other vias: 60.96,46.86
N$25
  Top 0.406: R15.1 5V.A
N$26
  Top 0.406: R9.1 12V.A
N$27  (via drill 0.6 pad 0)
  other vias: 59.69,46.86
N$28  (via drill 0.6 pad 0)
  other vias: 58.42,46.86
N$29
  Top 0.406: IC6.15 10.7,51.47 12.19,52.96 13.21,52.96 13.97,53.72 13.97,58.29 12.07,59.18 12.07,63.5 13.46,64.26 15.24,64.26 X2.3
N$30  (via drill 0.6)
  Top 0.406: IC6.16 10.05,51.96 11.81,53.72 12.32,53.72 12.95,54.36 v12.95,56.01
  Bottom 0.406: v12.95,56.01 X2.2
N$31
  Top 0.406: IC5.7 28.92,17.18 34.16,11.94 Q4.2 34.16,3.62 C12.2
N$32
  Top 0.406: IC5.8 29.82,18.06 38.99,8.89 Q4.1 38.99,3.57 C13.2
N$33  (via drill 0.6 pad 0)
  other vias: 57.15,46.86
N$34  (via drill 0.6 pad 0)
  other vias: 55.88,46.86
N$35  (via drill 0.6 pad 0)
  other vias: 54.61,46.86
N$36
  Top 0.406: IC6.19 8.1,54.65 C18.1
N$37
  Top 0.305: L1.2 14.53,52.12
  Top 0.406: 14.53,52.12 16,53.59 16,58.55 X2.1
N$38
  Top 0.406: IC6.17 9.4,52.46 10.54,53.59 C16.2
N$39
  Top 0.406: RX.A R19.2
N$40
  Top 0.406: TX.A R22.2
N$41
  Top 0.406: A.A R31.1
N$42  (via drill 0.51)
  Top 0.305: 58.29,38.61 R29.1 58.42,38.61 59.31,39.5 62.99,39.5 v63.63,40.13 | v51.31,26.42 51.31,27.69 B.A
  Bottom 0.305: v51.31,26.42 51.31,37.21 53.59,39.5 62.99,39.5 v63.63,40.13
N$43  (via drill 0.6 pad 0)
  other vias: 53.34,46.86
N$44
  Top 0.406: IC6.23 5.5,51.78 4.32,52.96 3.68,52.96 2.92,53.72 RX.C
N$45
  Top 0.406: IC6.22 6.15,52.4 4.95,53.59 TX.C
N$46
  Top 0.305: C19.1 2.67,39.5 2.67,40.77 1.27,42.16 1.27,43.69 1.91,44.32 2.54,44.32 2.92,43.94 2.92,43.31 IC6.2
N$47
  Top 0.406: R17.2 4.87,39.46 2.16,42.16 2.16,43.09 IC6.1
N$48
  Top 0.305: R18.2 8.51,39.5 8.38,39.59
  Top 0.406: IC6.5 4.85,42.01 7.28,39.59 8.38,39.59
N$50
  Top 0.406: IC7.1 12.27,36.4 13.34,37.47 15.62,37.47 16.13,37.97 16.13,40.01 IC7.5
N$51
  Top 0.406: T1.3 IC7.7 IC7.6
N$54  (via drill 0.6 pad 0)
  other vias: 57.15,45.59
N$55  (via drill 0.6 pad 0)
  other vias: 58.42,45.59
N$56  (via drill 0.6 pad 0)
  other vias: 59.69,45.59
N$57  (via drill 0.6 pad 0)
  other vias: 60.96,45.59
N$58  (via drill 0.6 pad 0)
  other vias: 62.23,45.59
N$62  (via drill 0.6 pad 0)
  other vias: 57.15,44.32
N$63  (via drill 0.6 pad 0)
  other vias: 58.42,44.32
N$64  (via drill 0.6 pad 0)
  other vias: 59.69,44.32
N$65  (via drill 0.6 pad 0)
  other vias: 60.96,44.32
N$66  (via drill 0.6 pad 0)
  other vias: 62.23,44.32
N$70  (via drill 0.6 pad 0)
  other vias: 57.15,43.05
N$71  (via drill 0.6 pad 0)
  other vias: 58.42,43.05
N$72  (via drill 0.6 pad 0)
  other vias: 59.69,43.05
N$73  (via drill 0.6 pad 0)
  other vias: 60.96,43.05
N$74  (via drill 0.6 pad 0)
  other vias: 62.23,43.05
N$75  (via drill 0.6 pad 0)
  other vias: 62.23,41.78
N$76  (via drill 0.6 pad 0)
  other vias: 60.96,41.78
N$77  (via drill 0.6 pad 0)
  other vias: 59.69,41.78
N$78  (via drill 0.6 pad 0)
  other vias: 58.42,41.78
N$79  (via drill 0.6 pad 0)
  other vias: 57.15,41.78
N$80  (via drill 0.6 pad 0)
  other vias: 55.88,41.78
N$81  (via drill 0.6 pad 0)
  other vias: 54.61,41.78
N$82  (via drill 0.6 pad 0)
  other vias: 53.34,41.78
N$83
  Top 0.305: R16.2 21.21,55.88 26.29,55.88 J1.8 26.8,56.52 28.07,57.79 | 28.07,57.79 J1.7 | J1.6 28.07,57.66 28.07,57.79
N$84  (via drill 0.6 pad 0)
  Top 0.61: v53.34,40.51 v54.61,40.51
N$85  (via drill 0.6 pad 0)
  other vias: 55.88,40.51
N$86  (via drill 0.6 pad 0)
  other vias: 57.15,40.51
N$87  (via drill 0.6 pad 0)
  other vias: 58.42,40.51
N$88  (via drill 0.6 pad 0)
  other vias: 59.69,40.51
N$89  (via drill 0.6 pad 0)
  other vias: 60.96,40.51
N$90  (via drill 0.6 pad 0)
  other vias: 62.23,40.51
N$91  (via drill 0.6 pad 0)
  other vias: 53.47,36.7
N$92  (via drill 0.6 pad 0)
  other vias: 54.74,36.7
N$93  (via drill 0.6 pad 0)
  other vias: 56.01,36.7
N$94  (via drill 0.6 pad 0)
  other vias: 57.28,36.7
N$95  (via drill 0.6 pad 0)
  other vias: 58.55,36.7
N$96  (via drill 0.6 pad 0)
  other vias: 59.82,36.7
N$97  (via drill 0.6 pad 0)
  other vias: 61.09,36.7
N$98  (via drill 0.6 pad 0)
  other vias: 62.36,36.7
N$99  (via drill 0.6 pad 0)
  other vias: 62.36,35.43
N$100  (via drill 0.6 pad 0)
  other vias: 61.09,35.43
N$101  (via drill 0.6 pad 0)
  other vias: 59.82,35.43
N$102  (via drill 0.6 pad 0)
  other vias: 58.55,35.43
N$103  (via drill 0.6 pad 0)
  other vias: 57.28,35.43
N$104  (via drill 0.6 pad 0)
  other vias: 56.01,35.43
N$105  (via drill 0.6 pad 0)
  other vias: 54.74,35.43
N$106  (via drill 0.6 pad 0)
  other vias: 53.47,35.43
N$110  (via drill 0.6 pad 0)
  other vias: 57.28,34.16
N$111  (via drill 0.6 pad 0)
  other vias: 58.55,34.16
N$112  (via drill 0.6 pad 0)
  other vias: 59.82,34.16
N$113  (via drill 0.6 pad 0)
  other vias: 61.09,34.16
N$114  (via drill 0.6 pad 0)
  other vias: 62.36,34.16
N$115  (via drill 0.6 pad 0)
  other vias: 62.36,32.89
N$116  (via drill 0.6 pad 0)
  other vias: 61.09,32.89
N$117  (via drill 0.6 pad 0)
  other vias: 59.82,32.89
N$118  (via drill 0.6 pad 0)
  other vias: 58.55,32.89
N$119  (via drill 0.6 pad 0)
  other vias: 57.28,32.89
N$126  (via drill 0.6 pad 0)
  other vias: 57.28,31.62
N$127  (via drill 0.6 pad 0)
  other vias: 58.55,31.62
N$128  (via drill 0.6 pad 0)
  other vias: 59.82,31.62
N$129  (via drill 0.6 pad 0)
  other vias: 61.09,31.62
N$130  (via drill 0.6 pad 0)
  other vias: 62.36,31.62
N$131  (via drill 0.6 pad 0)
  other vias: 53.47,30.35
N$132  (via drill 0.6 pad 0)
  other vias: 54.74,30.35
N$133  (via drill 0.6 pad 0)
  other vias: 56.01,30.35
N$134  (via drill 0.6 pad 0)
  other vias: 57.28,30.35
N$135  (via drill 0.6 pad 0)
  other vias: 58.55,30.35
N$136  (via drill 0.6 pad 0)
  other vias: 59.82,30.35
N$137  (via drill 0.6 pad 0)
  other vias: 61.09,30.35
N$138  (via drill 0.6 pad 0)
  other vias: 62.36,30.35
N$139  (via drill 0.6 pad 0)
  other vias: 62.36,29.08
N$140  (via drill 0.6 pad 0)
  other vias: 61.09,29.08
N$141  (via drill 0.6 pad 0)
  other vias: 59.82,29.08
N$142  (via drill 0.6 pad 0)
  other vias: 58.55,29.08
N$143  (via drill 0.6 pad 0)
  other vias: 57.28,29.08
N$144  (via drill 0.6 pad 0)
  other vias: 56.01,29.08
N$145  (via drill 0.6 pad 0)
  other vias: 54.74,29.08
N$146  (via drill 0.6 pad 0)
  other vias: 53.47,29.08
N$147  (via drill 0.6 pad 0)
  other vias: 53.47,26.8
N$148  (via drill 0.6 pad 0)
  other vias: 54.74,26.8
N$149  (via drill 0.6 pad 0)
  other vias: 56.01,26.8
N$150  (via drill 0.6 pad 0)
  other vias: 57.28,26.8
N$151  (via drill 0.6 pad 0)
  other vias: 58.55,26.8
N$152  (via drill 0.6 pad 0)
  other vias: 59.82,26.8
N$153  (via drill 0.6 pad 0)
  other vias: 61.09,26.8
N$154  (via drill 0.6 pad 0)
  other vias: 62.36,26.8
N$155  (via drill 0.6 pad 0)
  other vias: 62.36,25.53
N$156  (via drill 0.6 pad 0)
  other vias: 61.09,25.53
N$157  (via drill 0.6 pad 0)
  other vias: 59.82,25.53
N$158  (via drill 0.6 pad 0)
  other vias: 58.55,25.53
N$159  (via drill 0.6 pad 0)
  other vias: 57.28,25.53
N$160  (via drill 0.6 pad 0)
  other vias: 56.01,25.53
N$161  (via drill 0.6 pad 0)
  other vias: 54.74,25.53
N$162  (via drill 0.6 pad 0)
  other vias: 53.47,25.53
N$166  (via drill 0.6 pad 0)
  other vias: 57.28,24.26
N$167  (via drill 0.6 pad 0)
  other vias: 58.55,24.26
N$168  (via drill 0.6 pad 0)
  other vias: 59.82,24.26
N$169  (via drill 0.6 pad 0)
  other vias: 61.09,24.26
N$170  (via drill 0.6 pad 0)
  other vias: 62.36,24.26
N$171  (via drill 0.6 pad 0)
  other vias: 62.36,22.99
N$172  (via drill 0.6 pad 0)
  other vias: 61.09,22.99
N$173  (via drill 0.6 pad 0)
  other vias: 59.82,22.99
N$174  (via drill 0.6 pad 0)
  other vias: 58.55,22.99
N$175  (via drill 0.6 pad 0)
  other vias: 57.28,22.99
N$182  (via drill 0.6 pad 0)
  other vias: 57.28,21.72
N$183  (via drill 0.6 pad 0)
  other vias: 58.55,21.72
N$184  (via drill 0.6 pad 0)
  other vias: 59.82,21.72
N$185  (via drill 0.6 pad 0)
  other vias: 61.09,21.72
N$186  (via drill 0.6 pad 0)
  other vias: 62.36,21.72
N$187  (via drill 0.6 pad 0)
  other vias: 62.36,20.45
N$188  (via drill 0.6 pad 0)
  other vias: 61.09,20.45
N$189  (via drill 0.6 pad 0)
  other vias: 59.82,20.45
N$190  (via drill 0.6 pad 0)
  other vias: 58.55,20.45
N$191  (via drill 0.6 pad 0)
  other vias: 57.28,20.45
N$192  (via drill 0.6 pad 0)
  other vias: 56.01,20.45
N$193  (via drill 0.6 pad 0)
  other vias: 54.74,20.45
N$194  (via drill 0.6 pad 0)
  other vias: 53.47,20.45
N$195  (via drill 0.6 pad 0)
  other vias: 53.47,19.18
N$196  (via drill 0.6 pad 0)
  other vias: 54.74,19.18
N$197  (via drill 0.6 pad 0)
  other vias: 56.01,19.18
N$198  (via drill 0.6 pad 0)
  other vias: 57.28,19.18
N$199  (via drill 0.6 pad 0)
  other vias: 58.55,19.18
N$200  (via drill 0.6 pad 0)
  other vias: 59.82,19.18
N$201  (via drill 0.6 pad 0)
  other vias: 61.09,19.18
N$202  (via drill 0.6 pad 0)
  other vias: 62.36,19.18
RESET  (via drill 0.51)
  Top 0.305: 18.67,19.94 v20.07,18.54
  Top 0.406: C19.2 2.72,36.25 2.31,35.84 RESET.2 RESET.1 2.31,13.48 | IC5.29 20.68,21.95 18.67,19.94 17.27,18.54 9.4,18.54 8.51,17.65 8.51,14.22 8,13.72 4.83,13.72 3.45,12.34 | 2.31,13.48 3.45,12.34 | 3.45,12.34 R7.1 | 2.31,13.48 1.92,13.48 TP2.TP
  Bottom 0.305: v20.07,18.54 27.81,18.54 28.7,19.43 32.89,19.43 39.55,26.09 39.55,30.15 43.21,33.81 43.21,35.23 42.7,35.74 40.46,35.74 39.14,34.42 ICSP.5
RS485A
  Top 0.305: 21.46,51.45 R1.1 21.72,51.68 | J1.2 32.77,54.74 25.53,54.74 21.59,50.8 21.45,50.81
  Top 0.406: R1.1 21.45,50.81 21.42,50 21.21,49.78 IC4.6
RS485B  (via drill 0.51)
  Top 0.305: v19.43,52.83 19.43,51.69 19.56,51.56 R1.2
  Top 0.406: IC4.7 19.94,49.91 19.68,50.17 19.68,51.4 R1.2
  Bottom 0.305: J1.1 33.91,60.71 27.3,60.71 v19.43,52.83
RX  (via drill 0.5)
  Top 0.406: R17.1 5.38,37.29 v7.11,35.56 | IC4.1 18.67,41.78 v18.41,40.64 | IC5.30 21.66,21.15 v20.83,20.32
  Bottom 0.406: v7.11,35.56 8.51,34.16 10.16,34.16 16.64,40.64 v18.41,40.64 17.53,40.64 17.53,35.81 17.78,35.43 17.78,27.3 20.83,24.38 v20.83,20.32
SCL  (via drill 0.5, 0.51)
  Top 0.305: TP5.TP 22.1,13.21 v21.72,13.59
  Top 0.406: R21.1 JP4.4 | IC5.28 19.32,22.75 v19.05,22.48
  Bottom 0.305: v21.72,13.59 18.8,16.51 JP4.4
  Bottom 0.406: v19.05,22.48 19.05,16.89 JP4.4
SDA  (via drill 0.5, 0.51)
  Top 0.305: TP6.TP v8.2,10.54
  Top 0.406: JP4.3 R20.1 | IC5.27 18.22,23.55 18.03,23.37 18.03,21.84 17.78,21.59 v17.78,20.83
  Bottom 0.305: v8.2,10.54 11.05,10.54 15.75,15.24 15.75,16.13 JP4.3
  Bottom 0.406: v17.78,20.83 17.78,19.3 15.88,17.4 JP4.3
TX  (via drill 0.5)
  Top 0.406: R18.1 8.56,36.53 v9.4,35.69 | v23.75,40.64 23.75,41.6 IC4.4 | IC5.31 23.53,20.35 v24.89,21.72
  Bottom 0.406: v9.4,35.69 9.4,43.69 10.79,45.09 22.22,45.09 23.49,43.82 23.49,40.89 v23.75,40.64 23.75,34.67 22.61,33.53 19.18,33.53 18.8,33.15 18.8,28.19 21.08,25.91 22.99,25.91 24.89,24 v24.89,21.72
USBVCC  (via drill 0.51)
  Top 0.305: L1.1 14.61,46.74 14.61,44.83 T1.1 | 6.79,48.71 7.37,49.28 7.37,50.42 IC6.20 | 6.79,48.71 6.41,48.32 | 6.41,48.32 4.19,46.1 4.19,43.31 IC6.4 | v6.22,60.96 5.08,60.96 R22.1 | 6.41,48.32 v6.1,48.64 | 12.32,43.94 7.62,48.64 6.86,48.64 6.79,48.71 | TP3.TP 8.26,30.86 8.64,30.86 10.16,32.38 10.16,32.51
  Top 0.406: R22.1 R19.1 | IC7.2 13.54,33.48 12.57,32.51 10.16,32.51 C17.2 10.79,33.59 10.79,41.28 12.19,42.67 12.19,43.82 12.32,43.94 13.11,44.73 T1.1
  Bottom 0.305: 6.22,48.77 v6.1,48.64 6.22,48.9 5.21,49.91 5.21,59.94 v6.22,60.96
VCC  (via drill 0.51, 0.6 pad 0)
  Top 0.305: C6.2 61.85,66.17 | 37.85,43.31 ICSP.2 | 28.12,16.26 v30.38,13.61 | v42.8,10.03 43.18,10.03 43.94,9.27 44.83,9.27 R4.1 | v16.64,42.55 16.51,42.55 16.38,42.42
  Top 0.406: 18.67,45.9 IC4.8 | 18.67,45.9 T1.2 16.1,42.7 16.38,42.42 17.14,41.66 17.14,38.48 18.41,37.21 | 32.83,37.4 30.35,39.88 26.08,39.88 C4.1 26.04,40.89 24.26,42.67 24.26,44.45 22.86,45.85 18.72,45.85 18.67,45.9 | 32.83,37.4 33.02,37.21 C2.+ 29.72,33.63 29.72,28.57 28.92,27.78 IC5.18 28.96,26.61 28.96,25.4 27.81,24.26 27.81,19.3 | JP6.3 JP6.4 JP7.3 JP7.4 13.34,29.59 14.22,30.48 16.64,30.48 17.78,29.34 21.08,29.34 21.72,29.97 21.72,31.88 19.68,34.04 18.92,34.04 17.78,35.18 17.78,36.58 18.41,37.21 | X5.1 15.7,10.81 R20.2 | R20.2 R21.2 | 10.79,13.84 JP4.1 | 10.79,13.84 13.84,10.79 15.68,10.79 R20.2 | 10.79,13.84 8.89,11.94 R7.2 5.59,11.93 5.59,10.92 4.95,10.29 2.92,10.29 1.78,9.14 TP4.TP | IC5.4 26.52,18.85 26.87,19.3 27.81,19.3 | 27.81,19.3 28.12,18.99 IC5.6 28.12,16.26 28.12,15.18 C8.2 | 18.41,37.21 19.52,37.21 R2.2 | 37.59,43.05 36.7,43.05 33.15,39.5 33.15,37.72 32.83,37.4
  Top 0.61: 37.59,43.05 37.85,43.31 39.12,44.58 39.09,44.58 R15.2 40.98,45.43 v41.66,46.1 43.05,47.5 43.05,49.99 37.85,55.17 37.85,61.19 40.11,63.4 40.11,68.71 40.87,69.47 X1.1 44.96,70.61 46.61,72.26 54.48,72.26 55.25,71.5 55.25,70.37 R12.2 | IC4.8 18.03,51.56 C7.2 | C6.2 61.85,66.19 61.85,68.45 59.94,70.36 R12.2 | R12.2 55.75,70.36 56.9,69.21 56.9,68.13 IC8.4
  Bottom 0.305: v30.38,13.61 31.11,13.59 39.24,13.59 v42.8,10.03
  Bottom 0.406: JP6.3 13.34,19.68 10.79,17.14 JP4.1
(copper drawn outside any net)
  shapes: Bottom area x3, Top area x3

### Text on the board
tPlace: Shouts to: | THERMOCOUPLE | Catarina | Widget | Paxotron | Marisol | Bre3po | Hoeken | Phooky | Scribel | NYC Resistor | H. Mulliken | 1 | Design By: | T+ | MakerBot.com | License: GPLv3 | Copyright 2010 | T- | 15 | + | KEEP IT LOCKED | BASSDRIVE.COM | S | D | S | FAN | D | 1 | S | 1 | G | S | G | S | 1 | + | S | D | EXTRA | S | G | GND | 5V | A6 | 17 | A7 | 25 | Extruder | S | A2 | Controller | S | D | S | HEATER | A3 | v3.6 | REVC | G | SDA | SCL | Docs: wiki.makerbot.com/ec3 | 9 | 1B | 1 | 5V | GND | Big ups Arduino. | 9 | 1A | QUADRATURE | 1